# Altium schematic sheet MCUsubsystem.SchDoc
size A3; SheetNumber: 4; SheetTotal: 13
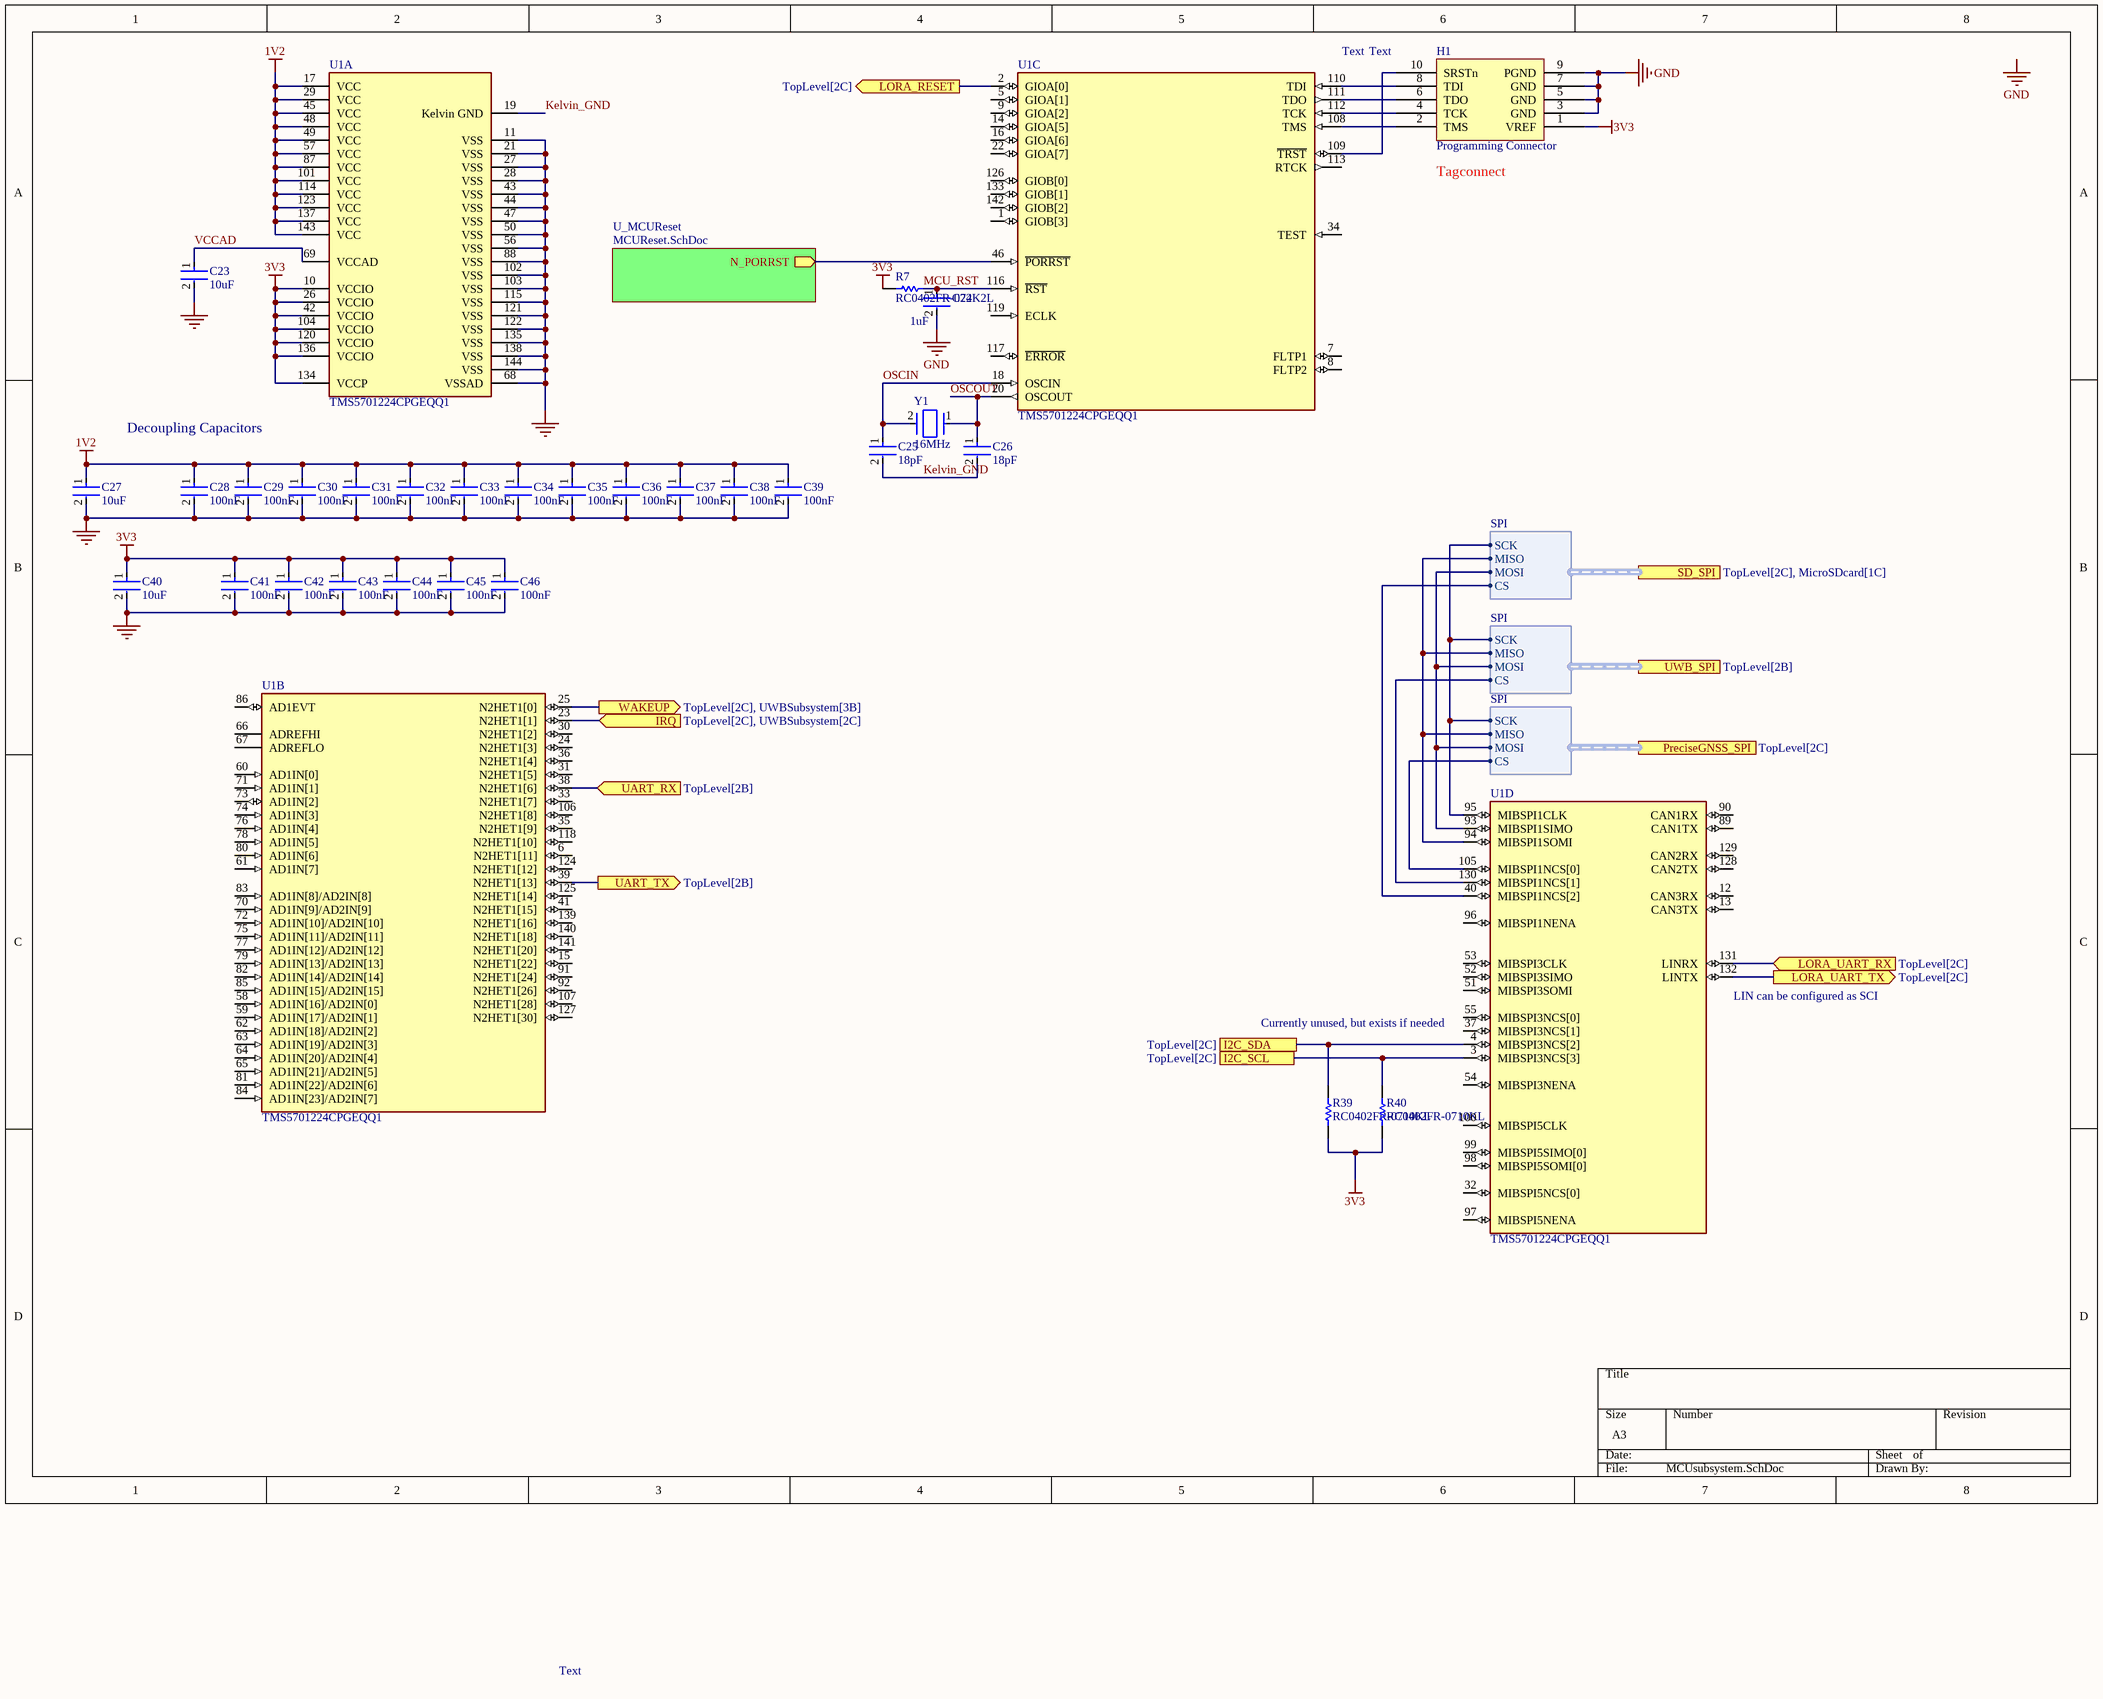
[diagram p0: MCUsubsystem.SchDoc]

## Parts
C23  10uF  [FP-GRM188-0_2-MFG]
C24  Capacitance: 1uF  [FP-CL511-IPC_C]  (hidden comment: CL05A105KP5NNNC)
C25  18pF  [FP-C0402-BB-MFG]
C26  18pF  [FP-C0402-BB-MFG]
C27  10uF  [FP-GRM188-0_2-MFG]
C28  100nF  [FP-GRM033-0_03-IPC_C]
C29  100nF  [FP-GRM033-0_03-IPC_C]
C30  100nF  [FP-GRM033-0_03-IPC_C]
C31  100nF  [FP-GRM033-0_03-IPC_C]
C32  100nF  [FP-GRM033-0_03-IPC_C]
C33  100nF  [FP-GRM033-0_03-IPC_C]
C34  100nF  [FP-GRM033-0_03-IPC_C]
C35  100nF  [FP-GRM033-0_03-IPC_C]
C36  100nF  [FP-GRM033-0_03-IPC_C]
C37  100nF  [FP-GRM033-0_03-IPC_C]
C38  100nF  [FP-GRM033-0_03-IPC_C]
C39  100nF  [FP-GRM033-0_03-IPC_C]
C40  10uF  [FP-GRM188-0_2-MFG]
C41  100nF  [FP-GRM033-0_03-IPC_C]
C42  100nF  [FP-GRM033-0_03-IPC_C]
C43  100nF  [FP-GRM033-0_03-IPC_C]
C44  100nF  [FP-GRM033-0_03-IPC_C]
C45  100nF  [FP-GRM033-0_03-IPC_C]
C46  100nF  [FP-GRM033-0_03-IPC_C]
H1  Programming Connector  [TC2050-IDC]  (no BOM)
R7  RC0402FR-072K2L  [RESC1005X40X25NL05T10]
R39  RC0402FR-0710KL  [RESC1005X40X25LL05T10]
R40  RC0402FR-0710KL  [RESC1005X40X25LL05T10]
U1  TMS5701224CPGEQQ1  [FP-PGE0144A-IPC_C]  (parts A,B,C,D of 4)
Y1  16MHz  [FP-ABM7-MFG]

## Sub-sheets
U_MCUReset = MCUReset.SchDoc: N_PORRST (out)

## Ports
I2C_SCL (see TopLevel[2C]), I2C_SDA (see TopLevel[2C]), IRQ (in, see TopLevel[2C], UWBSubsystem[2C]), LORA_RESET (out, see TopLevel[2C]), LORA_UART_RX (in, see TopLevel[2C]), LORA_UART_TX (out, see TopLevel[2C]), PreciseGNSS_SPI (harness SPI, see TopLevel[2C]), SD_SPI (harness SPI, see TopLevel[2C], MicroSDcard[1C]), UART_RX (in, see TopLevel[2B]), UART_TX (out, see TopLevel[2B]), UWB_SPI (harness SPI, see TopLevel[2B]), WAKEUP (out, see TopLevel[2C], UWBSubsystem[3B])

## Harnesses
SPI: SCK, MISO, MOSI, CS

## Nets
1V2: C27.1 C28.1 C29.1 C30.1 C31.1 C32.1 C33.1 C34.1 C35.1 C36.1 C37.1 C38.1 C39.1 U1.17(VCC) U1.29(VCC) U1.45(VCC) U1.48(VCC) U1.49(VCC) U1.57(VCC) U1.87(VCC) U1.101(VCC) U1.114(VCC) U1.123(VCC) U1.137(VCC) U1.143(VCC)
3V3: C40.1 C41.1 C42.1 C43.1 C44.1 C45.1 C46.1 H1.1(VREF) R7.2 R39.1 R40.1 U1.10(VCCIO) U1.26(VCCIO) U1.42(VCCIO) U1.104(VCCIO) U1.120(VCCIO) U1.134(VCCP) U1.136(VCCIO)
GND: C23.2 C24.2 C27.2 C28.2 C29.2 C30.2 C31.2 C32.2 C33.2 C34.2 C35.2 C36.2 C37.2 C38.2 C39.2 C40.2 C41.2 C42.2 C43.2 C44.2 C45.2 C46.2 H1.3(GND) H1.5(GND) H1.7(GND) H1.9(PGND) U1.11(VSS) U1.21(VSS) U1.27(VSS) U1.28(VSS) U1.43(VSS) U1.44(VSS) U1.47(VSS) U1.50(VSS) U1.56(VSS) U1.68(VSSAD) U1.88(VSS) U1.102(VSS) U1.103(VSS) U1.115(VSS) U1.121(VSS) U1.122(VSS) U1.135(VSS) U1.138(VSS) U1.144(VSS)
I2C_SCL: R40.2 U1.3(MIBSPI3NCS[3]) ; port I2C_SCL
I2C_SDA: R39.2 U1.4(MIBSPI3NCS[2]) ; port I2C_SDA
IRQ: U1.23(N2HET1[1]) ; port IRQ
Kelvin_GND: C25.2 C26.2 U1.19(Kelvin_GND)
LORA_RESET: U1.2(GIOA[0]) ; port LORA_RESET
LORA_UART_RX: U1.131(LINRX) ; port LORA_UART_RX
LORA_UART_TX: U1.132(LINTX) ; port LORA_UART_TX
MCU_RST: C24.1 R7.1 U1.116(~{RST})
OSCIN: C25.1 U1.18(OSCIN) Y1.2
OSCOUT: C26.1 U1.20(OSCOUT) Y1.1
UART_RX: U1.38(N2HET1[6]) ; port UART_RX
UART_TX: U1.39(N2HET1[13]) ; port UART_TX
VCCAD: C23.1 U1.69(VCCAD)
WAKEUP: U1.25(N2HET1[0]) ; port WAKEUP
NetH1_2: H1.2(TMS) U1.108(TMS)
NetH1_4: H1.4(TCK) U1.112(TCK)
NetH1_6: H1.6(TDO) U1.111(TDO)
NetH1_8: H1.8(TDI) U1.110(TDI)
NetH1_10: H1.10(SRSTn) U1.109(~{TRST})
NetU1_40: U1.40(MIBSPI1NCS[2]) ; port SD_SPI.CS
NetU1_46: U1.46(~{PORRST}) ; sheet U_MCUReset/N_PORRST
NetU1_93: U1.93(MIBSPI1SIMO) ; port UWB_SPI.MOSI, port PreciseGNSS_SPI.MOSI, port SD_SPI.MOSI
NetU1_94: U1.94(MIBSPI1SOMI) ; port UWB_SPI.MISO, port PreciseGNSS_SPI.MISO, port SD_SPI.MISO
NetU1_95: U1.95(MIBSPI1CLK) ; port UWB_SPI.SCK, port PreciseGNSS_SPI.SCK, port SD_SPI.SCK
NetU1_105: U1.105(MIBSPI1NCS[0]) ; port PreciseGNSS_SPI.CS
NetU1_130: U1.130(MIBSPI1NCS[1]) ; port UWB_SPI.CS

Not connected (* = marked no-connect by the designer): U1 1(GIOB[3]) 5(GIOA[1]) 6(N2HET1[11]) 7(FLTP1) 8(FLTP2) 9(GIOA[2]) 12(CAN3RX) 13(CAN3TX) 14(GIOA[5]) 15(N2HET1[22]) 16(GIOA[6]) 22(GIOA[7]) 24(N2HET1[3]) 30(N2HET1[2]) 31(N2HET1[5]) 32(MIBSPI5NCS[0]) 33(N2HET1[7]) 34(TEST) 35(N2HET1[9]) 36(N2HET1[4]) 37(MIBSPI3NCS[1]) 41(N2HET1[15]) 51(MIBSPI3SOMI) 52(MIBSPI3SIMO) 53(MIBSPI3CLK) 54(MIBSPI3NENA) 55(MIBSPI3NCS[0]) 58(AD1IN[16]/AD2IN[0]) 59(AD1IN[17]/AD2IN[1]) 60(AD1IN[0]) 61(AD1IN[7]) 62(AD1IN[18]/AD2IN[2]) 63(AD1IN[19]/AD2IN[3]) 64(AD1IN[20]/AD2IN[4]) 65(AD1IN[21]/AD2IN[5]) 66(ADREFHI) 67(ADREFLO) 70(AD1IN[9]/AD2IN[9]) 71(AD1IN[1]) 72(AD1IN[10]/AD2IN[10]) 73(AD1IN[2]) 74(AD1IN[3]) 75(AD1IN[11]/AD2IN[11]) 76(AD1IN[4]) 77(AD1IN[12]/AD2IN[12]) 78(AD1IN[5]) 79(AD1IN[13]/AD2IN[13]) 80(AD1IN[6]) 81(AD1IN[22]/AD2IN[6]) 82(AD1IN[14]/AD2IN[14]) 83(AD1IN[8]/AD2IN[8]) 84(AD1IN[23]/AD2IN[7]) 85(AD1IN[15]/AD2IN[15]) 86(AD1EVT) 89(CAN1TX) 90(CAN1RX) 91(N2HET1[24]) 92(N2HET1[26]) 96(MIBSPI1NENA) 97(MIBSPI5NENA) 98(MIBSPI5SOMI[0]) 99(MIBSPI5SIMO[0]) 100(MIBSPI5CLK) 106(N2HET1[8]) 107(N2HET1[28]) 113(RTCK) 117(~{ERROR}) 118(N2HET1[10]) 119(ECLK) 124(N2HET1[12]) 125(N2HET1[14]) 126(GIOB[0]) 127(N2HET1[30]) 128(CAN2TX) 129(CAN2RX) 133(GIOB[1]) 139(N2HET1[16]) 140(N2HET1[18]) 141(N2HET1[20]) 142(GIOB[2])

## Notes on the sheet
- (near U1) Text
- Text
- (near H1) Tagconnect
- Decoupling Capacitors
- (near U1) Currently unused, but exists if needed
- (near U1) LIN can be configured as SCI
- Labels drawn without touching a wire or pin: GND

## Library data of the parts
C23 C27 C40 = CMP-06035-002932-1: Chip Multilayer Ceramic Capacitors for General Purpose, 0603, 10uF, X6S, 22%, 20%, 10V; Case Code (Metric): 1608; Max Operating Temperature: 105°C; Voltage Rating (DC): 10V; Thickness: 0.031inch; Width: 0.031inch; Dielectric: X6S; Lead Free: Lead Free; REACH SVHC: No SVHC; Case/Package: 0603; Length: 0.063inch; Min Operating Temperature: -55°C; Package Quantity: 4000; Voltage Rating: 10V; Tolerance: 20%; Capacitance: 10uF; Packaging: Cut Tape; Material: Ceramic; Mount: Surface Mount; Case Code (Imperial): 0603; Height: 0.8mm
C24 = CMP-13271-001936-1: Cap Ceramic 1uF 10V X5R ±10% SMD 0402 +85°C Paper T/R; Depth: 0.5mm; Case Code (Imperial): 0402; Material: Ceramic; Mount: Surface Mount; Thickness: 0.022inch; Dielectric: X5R; Radiation Hardening: No; Case/Package: 0402; Length: 1mm; Tolerance: 10%; Max Operating Temperature: 85°C; Package Quantity: 1; Width: 0.02inch; Voltage Rating: 10V; Contact Plating: Tin; Height: 0.5mm; Min Operating Temperature: -55°C; Case Code (Metric): 1005; Packaging: Tape and Reel
C25 C26 = CMP-2008-03345-2: CAP CER 18PF 25V C0G/NP0 0402; Manufacturer Part Number: C0402C180J3GACTU; Manufacturer: Kemet; Material: Ceramic; Temperature Characteristic: C0G; Tolerance: 0.05; Temperature Coefficient: 15%; Temperature Range High: +125°C; Temperature: -55°C to +125°C; Voltage Rating: 25 V; Ipc Land Pattern Name: CAPC10050X50; Temperature Range Low: -55°C; Digikey Description: CAP CER 18PF 25V C0G/NP0 0402; Package: C0402-BB; Octopart: https://octopart.com/c0402c180j3gactu-kemet-12569103; Device Class L3: Ceramic Capacitors; Category: Cap; Automotive: No; Capacitance: 18 pF; Height: 0.55mm; RoHS: TRUE; ComponentLink2Description: Datasheet; Mouser Description: Multilayer Ceramic Capacitors MLCC - SMD/SMT 25volts 18pF C0G 5%; Value: 18 pF; Device Class L1: Passive Components; ComponentLink2URL: https://content.kemet.com/datasheets/KEM_C1002_X7R_SMD.pdf; Device Class L2: Capacitors; Lead Free: Yes
C28-C39 C41-C46 = CMP-2010-01264-2: Chip Multilayer Ceramic Capacitors for General Purpose, 0201, 0.10uF, X5R, 15%, 10%, 10V; Mount: Surface Mount; Dielectric: X5R; Width: 0.012inch; Tolerance: 10%; Radiation Hardening: No; Voltage Rating: 10V; REACH SVHC: No SVHC; Height: 0.3mm; Max Operating Temperature: 85°C; Voltage Rating (DC): 10V; Capacitance: 100nF; Thickness: 0.013inch; Termination: SMD/SMT; Lead Free: Lead Free; Package Quantity: 1; Case/Package: 0201; Min Operating Temperature: -55°C; Weight: 6E-06oz; Length: 0.6mm; Case Code (Imperial): 0201; Depth: 0.3mm; Voltage: 10V; Packaging: Tape and Reel; Case Code (Metric): 0603
H1 = CMP-CONN-00032-12: Header, JTAG 10-pin dual row programming connector; Value: 10 pin; Type: Debug Port; Design Item ID: CNNR00036; System: Connector
R7 = CMP-2002-07567-1: Manufacturer: Yageo / Phycomp; Part Number: RC0402FR-072K2L
R39 R40 = CMP-2002-07353-1: Manufacturer: Yageo / Phycomp; Part Number: RC0402FR-0710KL
U1 = CMP-04869-000009-2: TMS570LS1224 ACTIVE 16/32 Bit RISC Flash MCU, Cortex R4F, Auto Q10032-Bit RISC Flash Microcontroller; Manufacturer: Texas Instruments; Number Of A/D Converters: 2; Number Of Spi Channels: 3; Number Of Timers/Counters: 24; Max Junction Temp: +150°C; Number Of I/Os: 64; Core Architecture: ARM Cortex-R4F; Memory Size: 1280KBytes; Min Supply Voltage: 1.14V; Frequency: 160MHz; Data Bus Width: 32bits; Number Of I2C Channels: 1; Max Supply Voltage: 5.25V; Standoff Height: 0.05mm; Number Of Pwm Channels: 14; Interface: I2C,SPI,UART,CAN,LIN,SCI,Other; Ram Size: 192KBytes; Automotive Grade: Grade 1; Package: PGE0144A; Ambient Temperature Range Low: -40°C; Number Of Uart Channels: 2; Device Class L1: Integrated Circuits (ICs); Memory Type: FLASH; Number Of Cores: 2; Category: IC; Temperature: -40°C to +125°C; Device Class L3: Microcontrollers; Temperature Range High: +125°C; RoHS: TRUE; Height: 1.6mm; ComponentLink2URL: http://www.ti.com/lit/ds/symlink/tms570ls1224.pdf; Ambient Temperature Range High: +125°C; Temperature Range Low: -40°C; Device Class L2: Embedded Processors and Controllers; Lead Free: Yes; Number Of Adc Channels: 24; Octopart: https://octopart.com/tms5701224cpgeqq1-texas+instruments-61765979; ComponentLink2Description: Datasheet; Manufacturer Part Number: TMS5701224CPGEQQ1; Automotive: Yes
Y1 = CMP-27762-000095-1: Crystal 16MHz ±20ppm 18pF SMD-2 6mm x 3.5mm; ESR (Equivalent Series Resistance): 50R; Frequency Stability: 30ppm; Width: 3.3mm; Frequency: 16MHz; Radiation Hardening: No; Height: 0.055inch; Tolerance: 20ppm; Length: 6mm; Case/Package: CSMD; Lead Free: Lead Free; Min Operating Temperature: -40°C; Termination: SMD/SMT; Operating Frequency: 16 MHz; Resistor Type: Ceramic; Packaging: Tape and Reel; Mount: Surface Mount; Load Capacitance: 18pF; Frequency Tolerance: 20ppm; Depth: 3.5mm; Series: ABM7; Package Quantity: 1000; Max Operating Temperature: 85°C; Number of Pins: 2